# Altium schematic sheet DriverBoard_MCU.SchDoc
size 840 x 594 mm; DocumentNumber: Введите номер платы + Э3; SheetNumber: 4; Format: A1
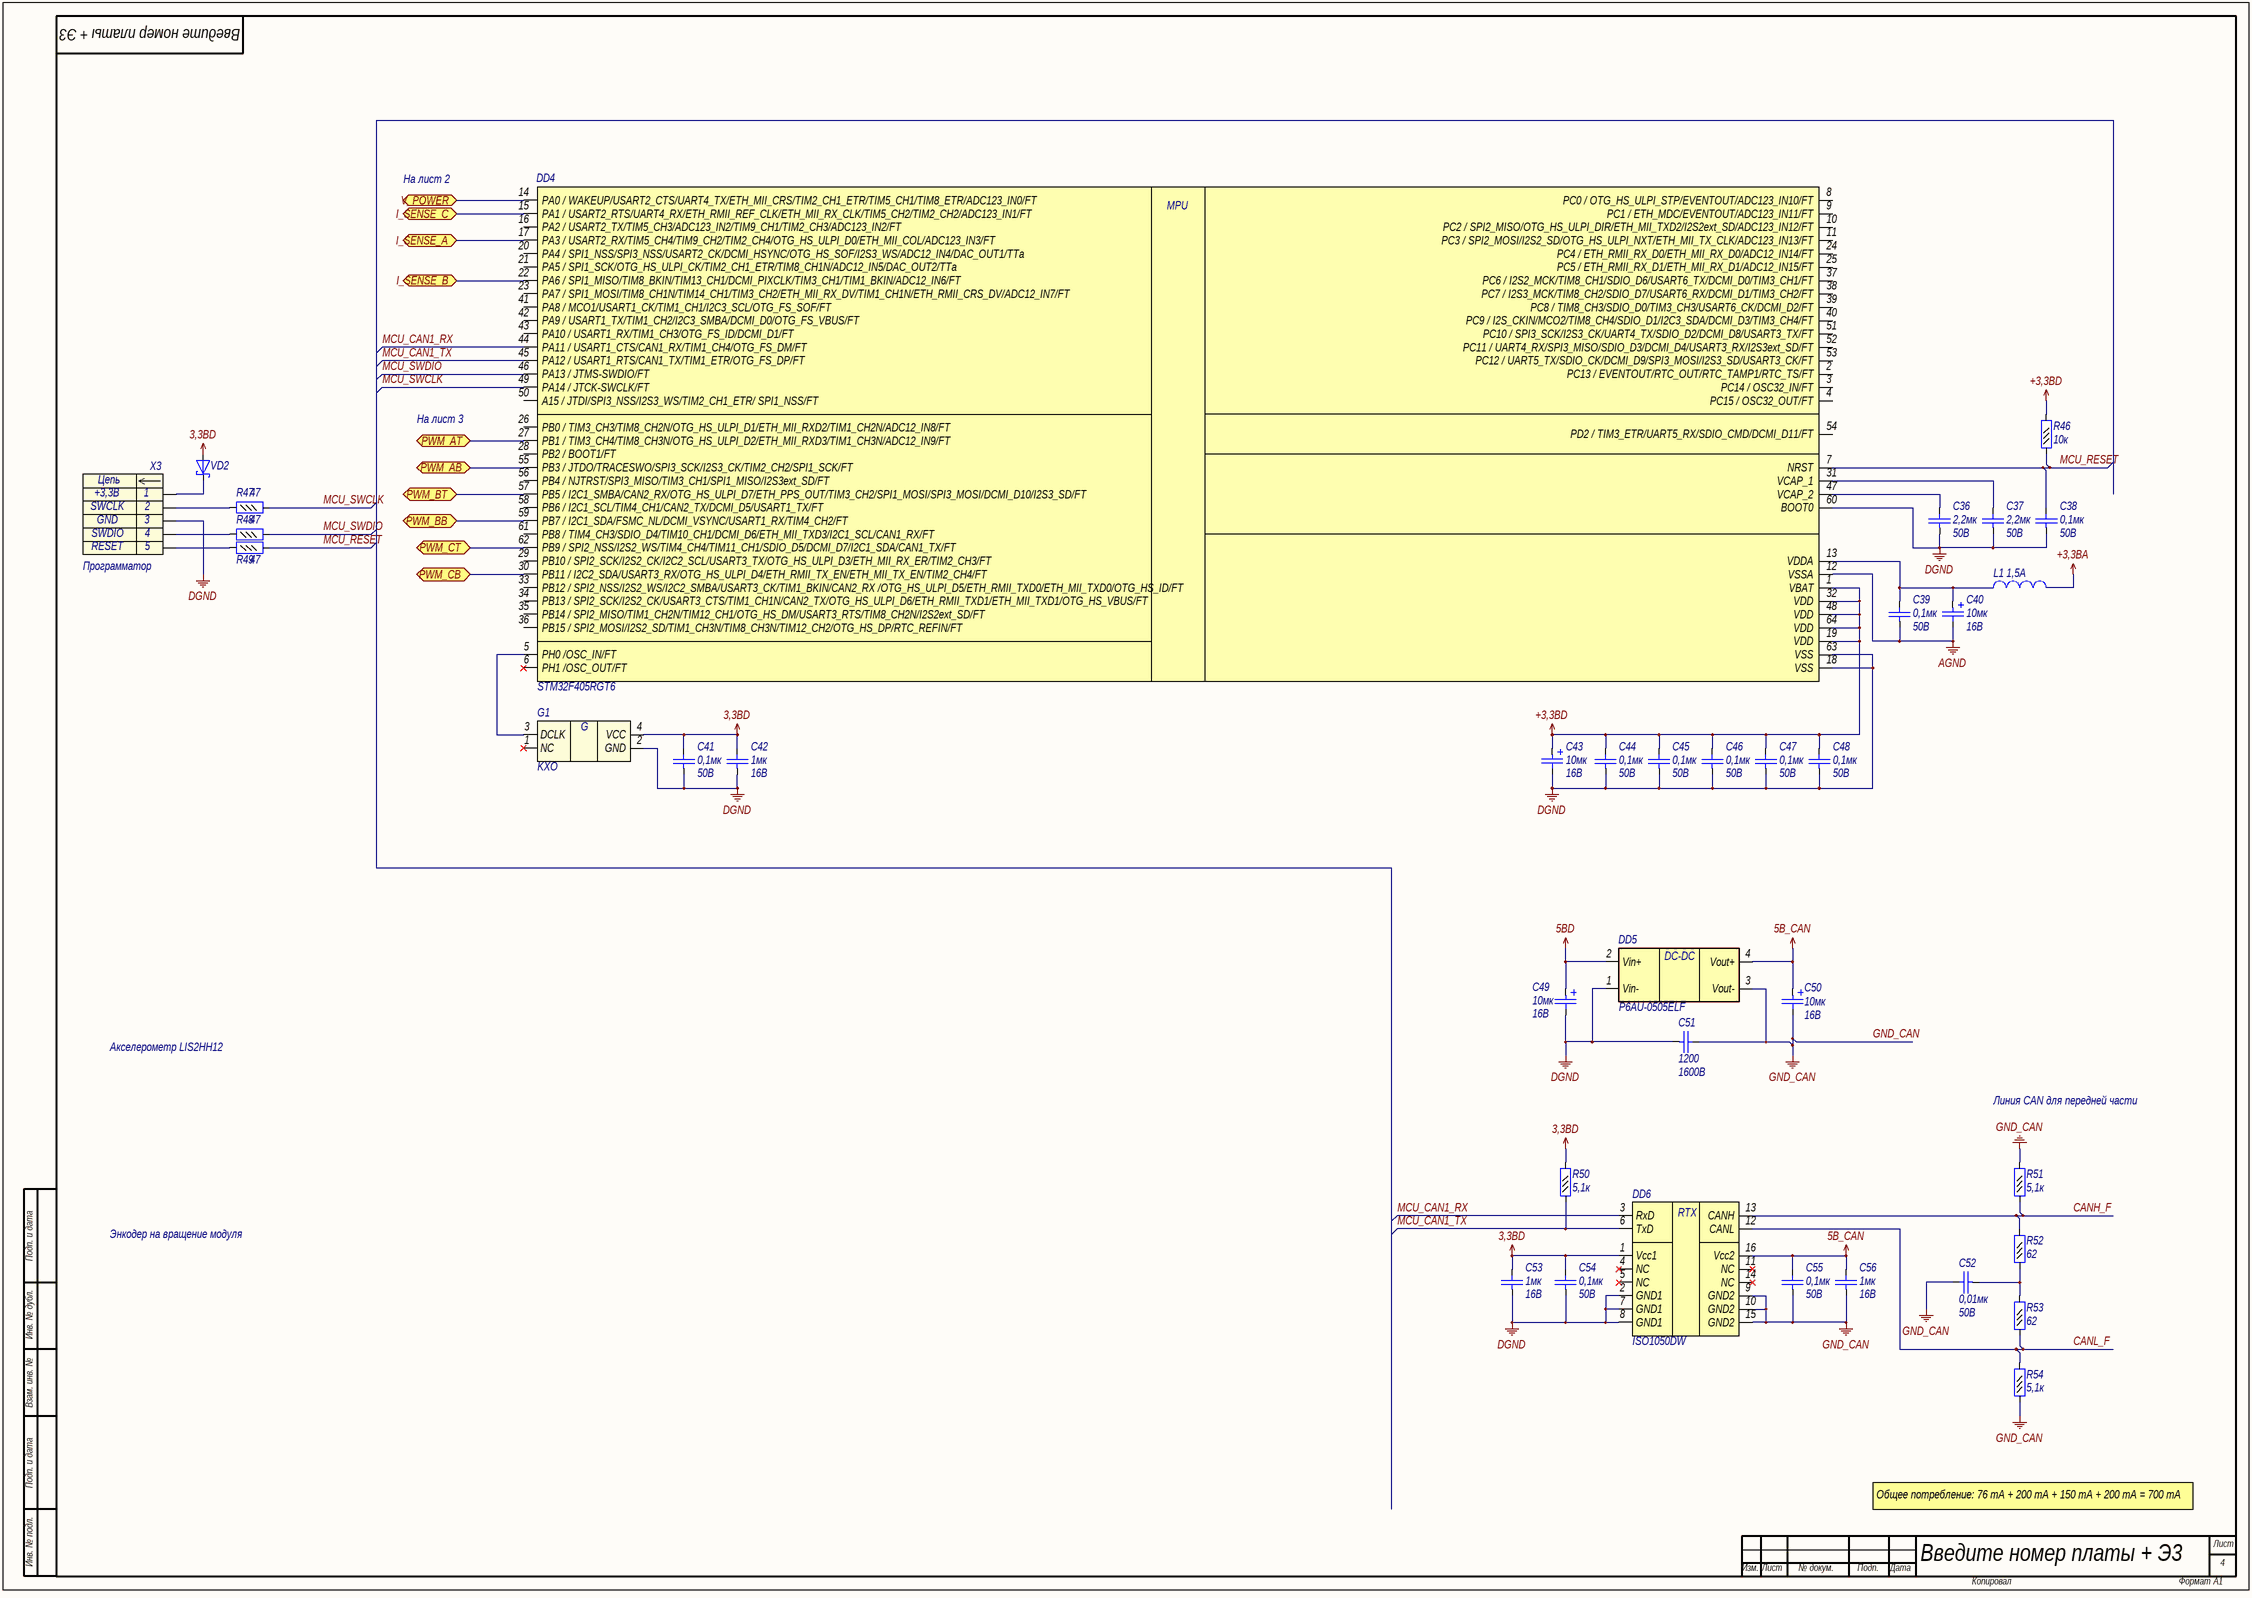
[diagram p0: DriverBoard_MCU.SchDoc]

## Parts
C36  value 2,2мк  Voltage: 50B  [C0603]  (hidden comment: Capacitor)
C37  value 2,2мк  Voltage: 50B  [C0603]  (hidden comment: Capacitor)
C38  value 0,1мк  Voltage: 50В  [C0402]  (hidden comment: Capacitor)
C39  value 0,1мк  Voltage: 50В  [C0402]  (hidden comment: Capacitor)
C40  value 10мк  Voltage: 16В  [TANTAL CASE A]  (hidden comment: Capacitor_pol)
C41  value 0,1мк  Voltage: 50В  [C0402]  (hidden comment: Capacitor)
C42  value 1мк  Voltage: 16B  [C0603]  (hidden comment: Capacitor)
C43  value 10мк  Voltage: 16В  [TANTAL CASE A]  (hidden comment: Capacitor_pol)
C44  value 0,1мк  Voltage: 50В  [C0402]  (hidden comment: Capacitor)
C45  value 0,1мк  Voltage: 50В  [C0402]  (hidden comment: Capacitor)
C46  value 0,1мк  Voltage: 50В  [C0402]  (hidden comment: Capacitor)
C47  value 0,1мк  Voltage: 50В  [C0402]  (hidden comment: Capacitor)
C48  value 0,1мк  Voltage: 50В  [C0402]  (hidden comment: Capacitor)
C49  value 10мк  Voltage: 16В  [TANTAL CASE A]  (hidden comment: Capacitor_pol)
C50  value 10мк  Voltage: 16В  [TANTAL CASE A]  (hidden comment: Capacitor_pol)
C51  value 1200  Voltage: 1600B  [K78-2]  (hidden comment: Capacitor)
C52  value 0,01мк  Voltage: 50B  [C0603]  (hidden comment: Capacitor)
C53  value 1мк  Voltage: 16B  [C0603]  (hidden comment: Capacitor)
C54  value 0,1мк  Voltage: 50B  [C0603]  (hidden comment: Capacitor)
C55  value 0,1мк  Voltage: 50B  [C0603]  (hidden comment: Capacitor)
C56  value 1мк  Voltage: 16B  [C0603]  (hidden comment: Capacitor)
DD4  STM32F405RGT6  [LQFP64]
DD5  Part Number: P6AU-0505ELF  [SIP4]  (hidden comment: P6AU-xxxxELF)
DD6  (no value)  [SO16]
G1  KXO  [QSMD7x5.2x1.8]
L1  Rated Current: 1,5A  [L0603]  (hidden comment: Inductor)
R46  value 10к  [R0402]  (hidden comment: Resistor_0,062Вт)
R47  value 47  [R0402]  (hidden comment: Resistor_0,062Вт)
R48  value 47  [R0402]  (hidden comment: Resistor_0,062Вт)
R49  value 47  [R0402]  (hidden comment: Resistor_0,062Вт)
R50  value 5,1к  [R0603]  (hidden comment: Resistor_0,062Вт)
R51  value 5,1к  [R0603]  (hidden comment: Resistor_0,062Вт)
R52  value 62  [R0603]  (hidden comment: Resistor_0,062Вт)
R53  value 62  [R0603]  (hidden comment: Resistor_0,062Вт)
R54  value 5,1к  [R0603]  (hidden comment: Resistor_0,062Вт)
VD2  DiodeSchottky  [SOD-323]  (value not drawn)
X3  Header_5_plg  [PLS-5]  (value not drawn)

## Ports
I_SENSE_A, I_SENSE_B, I_SENSE_C, PWM_AB, PWM_AT, PWM_BB, PWM_BT, PWM_CB, PWM_CT, V_POWER

## Nets
3,3BD: C41.2 C42.2 C53.2 C54.2 DD6.1(Vcc1) G1.4(VCC) R50.2 VD2.2(A)
5B_CAN: C50.1 C55.2 C56.2 DD5.4(Vout+) DD6.16(Vcc2)
5BD: C49.1 DD5.2(Vin+)
+3,3BA: L1.2
+3,3BD: C43.1 C44.2 C45.2 C46.2 C47.2 C48.2 DD4.1(VBAT) DD4.19(VDD) DD4.32(VDD) DD4.48(VDD) DD4.64(VDD) R46.2
AGND: C39.1 C40.2 DD4.12(VSSA)
DGND: C36.1 C37.1 C38.1 C41.1 C42.1 C43.2 C44.1 C45.1 C46.1 C47.1 C48.1 C49.2 C51.1 C53.1 C54.1 DD4.18(VSS) DD4.60(BOOT0) DD4.63(VSS) DD5.1(Vin-) DD6.2(GND1) DD6.7(GND1) DD6.8(GND1) G1.2(GND) X3.3
GND_CAN: C50.2 C51.2 C52.2 C55.1 C56.1 DD5.3(Vout-) DD6.9(GND2) DD6.10(GND2) DD6.15(GND2) R51.2 R54.1
CANH_F: DD6.13(CANH) R51.1 R52.2
CANL_F: DD6.12(CANL) R53.1 R54.2
I_SENSE_A: DD4.17(PA3_/_USART2_RX/TIM5_CH4/TIM9_CH2/TIM2_CH4/OTG_HS_ULPI_D0/ETH_MII_COL/ADC123_IN3/FT) ; port I_SENSE_A
I_SENSE_B: DD4.22(PA6_/_SPI1_MISO/TIM8_BKIN/TIM13_CH1/DCMI_PIXCLK/TIM3_CH1/TIM1_BKIN/ADC12_IN6/FT) ; port I_SENSE_B
I_SENSE_C: DD4.15(PA1_/_USART2_RTS/UART4_RX/ETH_RMII_REF_CLK/ETH_MII_RX_CLK/TIM5_CH2/TIM2_CH2/ADC123_IN1/FT) ; port I_SENSE_C
MCU_CAN1_RX: DD4.44(PA11_/_USART1_CTS/CAN1_RX/TIM1_CH4/OTG_FS_DM/FT) DD6.3(RxD)
MCU_CAN1_TX: DD4.45(PA12_/_USART1_RTS/CAN1_TX/TIM1_ETR/OTG_FS_DP/FT) DD6.6(TxD) R50.1
MCU_RESET: C38.2 DD4.7(NRST) R46.1 R49.2
MCU_SWCLK: DD4.49(PA14_/_JTCK-SWCLK/FT) R47.2
MCU_SWDIO: DD4.46(PA13_/_JTMS-SWDIO/FT) R48.2
PWM_AB: DD4.55(PB3_/_JTDO/TRACESWO/SPI3_SCK/I2S3_CK/TIM2_CH2/SPI1_SCK/FT) ; port PWM_AB
PWM_AT: DD4.27(PB1_/_TIM3_CH4/TIM8_CH3N/OTG_HS_ULPI_D2/ETH_MII_RXD3/TIM1_CH3N/ADC12_IN9/FT) ; port PWM_AT
PWM_BB: DD4.59(PB7_/_I2C1_SDA/FSMC_NL/DCMI_VSYNC/USART1_RX/TIM4_CH2/FT) ; port PWM_BB
PWM_BT: DD4.57(PB5_/_I2C1_SMBA/CAN2_RX/OTG_HS_ULPI_D7/ETH_PPS_OUT/TIM3_CH2/SPI1_MOSI/SPI3_MOSI/DCMI_D10/I2S3_SD/FT) ; port PWM_BT
PWM_CB: DD4.30(PB11_/_I2C2_SDA/USART3_RX/OTG_HS_ULPI_D4/ETH_RMII_TX_EN/ETH_MII_TX_EN/TIM2_CH4/FT) ; port PWM_CB
PWM_CT: DD4.62(PB9_/_SPI2_NSS/I2S2_WS/TIM4_CH4/TIM11_CH1/SDIO_D5/DCMI_D7/I2C1_SDA/CAN1_TX/FT) ; port PWM_CT
V_POWER: DD4.14(PA0_/_WAKEUP/USART2_CTS/UART4_TX/ETH_MII_CRS/TIM2_CH1_ETR/TIM5_CH1/TIM8_ETR/ADC123_IN0/FT) ; port V_POWER
NetC36_2: C36.2 DD4.47(VCAP_2)
NetC37_2: C37.2 DD4.31(VCAP_1)
NetC39_2: C39.2 C40.1 DD4.13(VDDA) L1.1
NetC52_1: C52.1 R52.1 R53.2
NetDD4_5: DD4.5(PH0_/OSC_IN/FT) G1.3(DCLK)
NetR47_1: R47.1 X3.2
NetR48_1: R48.1 X3.4
NetR49_1: R49.1 X3.5
NetVD2_1: VD2.1(K) X3.1

Not connected (* = marked no-connect by the designer): DD4 2(PC13_/_EVENTOUT/RTC_OUT/RTC_TAMP1/RTC_TS/FT) 3(PC14_/_OSC32_IN/FT) 4(PC15_/_OSC32_OUT/FT) 6(PH1_/OSC_OUT/FT)* 8(PC0_/_OTG_HS_ULPI_STP/EVENTOUT/ADC123_IN10/FT) 9(PC1_/_ETH_MDC/EVENTOUT/ADC123_IN11/FT) 10(PC2_/_SPI2_MISO/OTG_HS_ULPI_DIR/ETH_MII_TXD2/I2S2ext_SD/ADC123_IN12/FT) 11(PC3_/_SPI2_MOSI/I2S2_SD/OTG_HS_ULPI_NXT/ETH_MII_TX_CLK/ADC123_IN13/FT) 16(PA2_/_USART2_TX/TIM5_CH3/ADC123_IN2/TIM9_CH1/TIM2_CH3/ADC123_IN2/FT) 20(PA4_/_SPI1_NSS/SPI3_NSS/USART2_CK/DCMI_HSYNC/OTG_HS_SOF/I2S3_WS/ADC12_IN4/DAC_OUT1/TTa) 21(PA5_/_SPI1_SCK/OTG_HS_ULPI_CK/TIM2_CH1_ETR/TIM8_CH1N/ADC12_IN5/DAC_OUT2/TTa) 23(PA7_/_SPI1_MOSI/TIM8_CH1N/TIM14_CH1/TIM3_CH2/ETH_MII_RX_DV/TIM1_CH1N/ETH_RMII_CRS_DV/ADC12_IN7/FT) 24(PC4_/_ETH_RMII_RX_D0/ETH_MII_RX_D0/ADC12_IN14/FT) 25(PC5_/_ETH_RMII_RX_D1/ETH_MII_RX_D1/ADC12_IN15/FT) 26(PB0_/_TIM3_CH3/TIM8_CH2N/OTG_HS_ULPI_D1/ETH_MII_RXD2/TIM1_CH2N/ADC12_IN8/FT) 28(PB2_/_BOOT1/FT) 29(PB10_/_SPI2_SCK/I2S2_CK/I2C2_SCL/USART3_TX/OTG_HS_ULPI_D3/ETH_MII_RX_ER/TIM2_CH3/FT) 33(PB12_/_SPI2_NSS/I2S2_WS/I2C2_SMBA/USART3_CK/TIM1_BKIN/CAN2_RX_/OTG_HS_ULPI_D5/ETH_RMII_TXD0/ETH_MII_TXD0/OTG_HS_ID/FT) 34(PB13_/_SPI2_SCK/I2S2_CK/USART3_CTS/TIM1_CH1N/CAN2_TX/OTG_HS_ULPI_D6/ETH_RMII_TXD1/ETH_MII_TXD1/OTG_HS_VBUS/FT) 35(PB14_/_SPI2_MISO/TIM1_CH2N/TIM12_CH1/OTG_HS_DM/USART3_RTS/TIM8_CH2N/I2S2ext_SD/FT) 36(PB15_/_SPI2_MOSI/I2S2_SD/TIM1_CH3N/TIM8_CH3N/TIM12_CH2/OTG_HS_DP/RTC_REFIN/FT) 37(PC6_/_I2S2_MCK/TIM8_CH1/SDIO_D6/USART6_TX/DCMI_D0/TIM3_CH1/FT) 38(PC7_/_I2S3_MCK/TIM8_CH2/SDIO_D7/USART6_RX/DCMI_D1/TIM3_CH2/FT) 39(PC8_/_TIM8_CH3/SDIO_D0/TIM3_CH3/USART6_CK/DCMI_D2/FT) 40(PC9_/_I2S_CKIN/MCO2/TIM8_CH4/SDIO_D1/I2C3_SDA/DCMI_D3/TIM3_CH4/FT) 41(PA8_/_MCO1/USART1_CK/TIM1_CH1/I2C3_SCL/OTG_FS_SOF/FT) 42(PA9_/_USART1_TX/TIM1_CH2/I2C3_SMBA/DCMI_D0/OTG_FS_VBUS/FT) 43(PA10_/_USART1_RX/TIM1_CH3/OTG_FS_ID/DCMI_D1/FT) 50(A15_/_JTDI/SPI3_NSS/I2S3_WS/TIM2_CH1_ETR/_SPI1_NSS/FT) 51(PC10_/_SPI3_SCK/I2S3_CK/UART4_TX/SDIO_D2/DCMI_D8/USART3_TX/FT) 52(PC11_/_UART4_RX/SPI3_MISO/SDIO_D3/DCMI_D4/USART3_RX/I2S3ext_SD/FT) 53(PC12_/_UART5_TX/SDIO_CK/DCMI_D9/SPI3_MOSI/I2S3_SD/USART3_CK/FT) 54(PD2_/_TIM3_ETR/UART5_RX/SDIO_CMD/DCMI_D11/FT) 56(PB4_/_NJTRST/SPI3_MISO/TIM3_CH1/SPI1_MISO/I2S3ext_SD/FT) 58(PB6_/_I2C1_SCL/TIM4_CH1/CAN2_TX/DCMI_D5/USART1_TX/FT) 61(PB8_/_TIM4_CH3/SDIO_D4/TIM10_CH1/DCMI_D6/ETH_MII_TXD3/I2C1_SCL/CAN1_RX/FT); DD6 4(NC)* 5(NC)* 11(NC)* 14(NC)*; G1 1(NC)*

## Notes on the sheet
- На лист 2
- На лист 3
- (near X3) Программатор
- Акселерометр LIS2HH12
- Линия CAN для передней части
- Подп. и дата
- Энкодер на вращение модуля
- Инв. № дубл.
- Взам. инв. №
- Общее потребление: 76 mA + 200 mA + 150 mA + 200 mA = 700 mA
- Инв. № подл.
- Лист
- Изм.
- № докум.
- Подп.
- Дата
- Копировал
- Формат
- (in symbol connect6) Цепь
- (in symbol crystal10) G
- (in symbol interf22) RTX
- (in symbol microcont10) MPU
- (in symbol pwr52) DC-DC

## Library data of the parts
C36 C37 = cap134: Конденсатор; Part Name: Ceramic; Manufacture: Murata; Part Number: GRM188R71A225KE15D; id: cap134; TKE: X7R
C38 C39 C41 C44-C48 = cap277: Конденсатор; Part Name: Ceramic; Manufacture: Murata; Part Number: GRM155R71H104KE14D; id: cap277; TKE: X7R; tga: 0,10%
C40 C43 C49 C50 = cap199: Конденсатор полярный; Part Name: Tantal; Manufacture: Vishay; Part Number: 293D106X9016A2TE3; id: cap199
C42 C53 C56 = cap133: Конденсатор; Part Name: Ceramic; Manufacture: Murata; Part Number: GRM188R71C105KA12D**; id: cap133; TKE: X7R
C51 = cap276: Конденсатор; Part Name: Film; Manufacture: Россия; Part Number: К78-2-1200пФ-1600В,10%; id: cap276; tga: 0,10%
C52 = cap124: Конденсатор; Part Name: Ceramic; Manufacture: Murata; Part Number: GRM188R71H103K; id: cap124; TKE: X7R
C54 C55 = cap131: Конденсатор; Part Name: Ceramic; Manufacture: Murata; Part Number: GRM188R71H104KA93D; id: cap131; TKE: X7R
DD4 = microcont10: Part Name: Microcontroller; Frequency: 168MHz; ADC: 16x12b/2x12b; Interface: can, i2c, irda, lin, spi, uart, usbotg,sdio; Flash: 1Mb; Pin in: 51; Power Supply: 1.8-3.6V; id: microcont10; Part Number: STM32F405RGT6
DD5 = pwr52: DC/DC преобразователь; Part Name: DC/DC Converter Isolated; Manufacturer: PEAK Electronics; id: pwr52; Input Voltage: 5B; Current: 200mA; Type: Isolated; Output Voltage: 5B
DD6 = interf22: Isolated CAN Transceiver; Manufacture: Texas Instruments; Number of Channel: 1; Type Supply: Single Polar; Current Consumption: 76mA; Power Supply: 3-5,5В/4,75-5,25В; id: interf22; Part Name: Isolated CAN Transceiver; Part Number: ISO1050DW
G1 = crystal10: Кварц. генер. 32.768 МГц (HCMOS/TTL); Manufacture: GEYER; Part Number: KXO-V97; Frequence: 12MHz; id: crystal10
L1 = ind0: EMI Suppression Filter; Part Name: EMI Suppression Filters; Part Number: BLM18PG181SN1D; id: ind0; Resistance: 0,09Ohm
R46 = res294: Резистор; Manufacture: Yageo; Part Number: RC0402FR-0710KL; id: res294; Accuracy: 0,01; Part Name: Resistor; Power: 0,062Вт
R47-R49 = res238: Резистор; Manufacture: Yageo; Part Number: RC0402FR-0747RL; id: res238; Accuracy: 0,01; Part Name: Resistor; Power: 0,062Вт
R50 R51 R54 = res480: Резистор; Manufacture: Yageo; Part Number: RC0603FR-075K1; id: res480; Accuracy: 0,01; Part Name: Resistor; Power: 0,062Вт
R52 R53 = res434: Резистор; Manufacture: Yageo; Part Number: RC0603FR-0762RL; id: res434; Accuracy: 0,01; Part Name: Resistor; Power: 0,062Вт
VD2 = diode19: Диод Шоттки; Part Number: PMEG4010BEA.115; Manufacture: NXP Semiconductor; Max Reverse Voltage: 40B; Forward Voltage: 0,64B; Forward Current: 10mA; Capacitance: 50pF; Number of Channels: 1; id: diode19; Part Name: Diode Schottky
X3 = connect6: Разъем - 5 конт. вилка; Part Number: DS1021-1*5SF112-B; Manufacture: Ningbo connfly electronic; Contact_1: +3,3B; Contact_2: SWCLK; Contact_3: GND; Contact_4: SWDIO; Contact_5: RESET; Etch: 2,54mm; Part Name: PLS-5; id: connect6